# EAGLE schematic 7seg4digits (EAGLE 7.5.0)
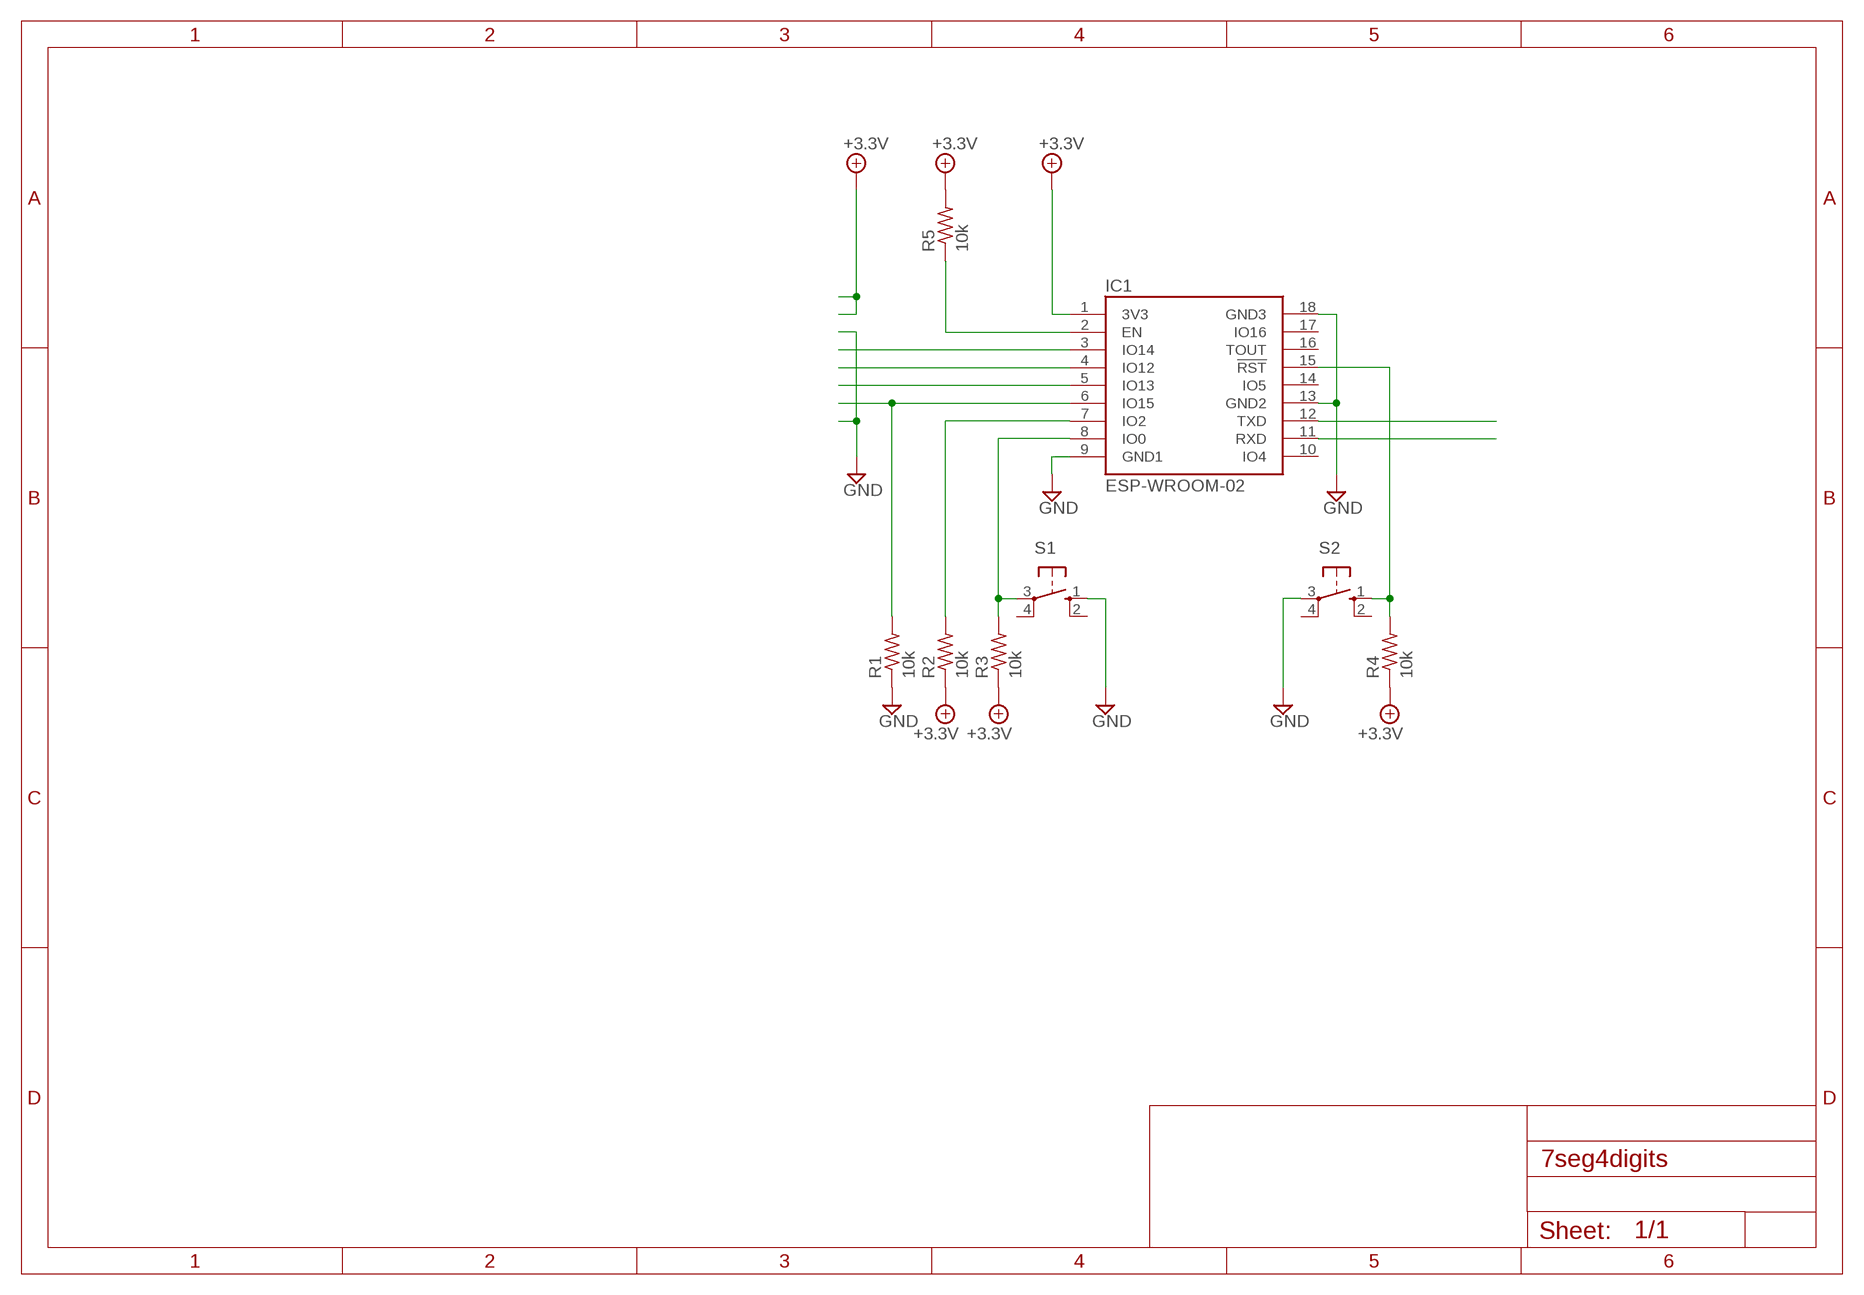
[diagram p0: schematic, sheet 1]

## Parts
IC1  ESP-WROOM-02  [WROOM-02]
R1  10k  R  [0309/12]
R2  10k  R  [0309/12]
R3  10k  R  [0309/12]
R4  10k  R  [0309/12]
R5  10k  R  [0309/12]
S1  10-XX(タクトスイッチ)  [B3F-10XX]
S2  10-XX(タクトスイッチ)  [B3F-10XX]

## Nets
+3.3V: IC1.1(3V3) R2.1 R3.1 R4.1 R5.2
GND: IC1.9(GND1) IC1.13(GND2) IC1.18(GND3) R1.1 S1.1(S) S2.3(P)
N$1: IC1.6(IO15) R1.2
N$2: IC1.5(IO13)
N$3: IC1.4(IO12)
N$4: IC1.15(!RST!) R4.2 S2.1(S)
N$5: IC1.7(IO2) R2.2
N$7: IC1.12(TXD)
N$8: IC1.3(IO14)
N$9: IC1.11(RXD)
N$10: IC1.8(IO0) R3.2 S1.3(P)
N$15: IC1.2(EN) R5.1
Unconnected: IC1.10(IO4) IC1.14(IO5) IC1.16(TOUT) IC1.17(IO16) S1.2(S1) S1.4(P1) S2.2(S1) S2.4(P1)

## Library data of the parts
IC1 = MyLibraries:ESP-WROOM-02: ESP8266 WROOM-02
R1-R5 = MyLibraries:R
S1 S2 = MyLibraries:10-XX(タクトスイッチ): OMRON SWITCH 秋月電子 <http://akizukidenshi.com/catalog/g/gP-03648/>; MPN: B3F-1000; OC_FARNELL: 176432; OC_NEWARK: 36M3542